# Altium schematic sheet IDD_measurement.SchDoc
size A4; DocumentNumber: 5; Revision: C.1(PCB.SCH); SheetNumber: 5; SheetTotal: 6
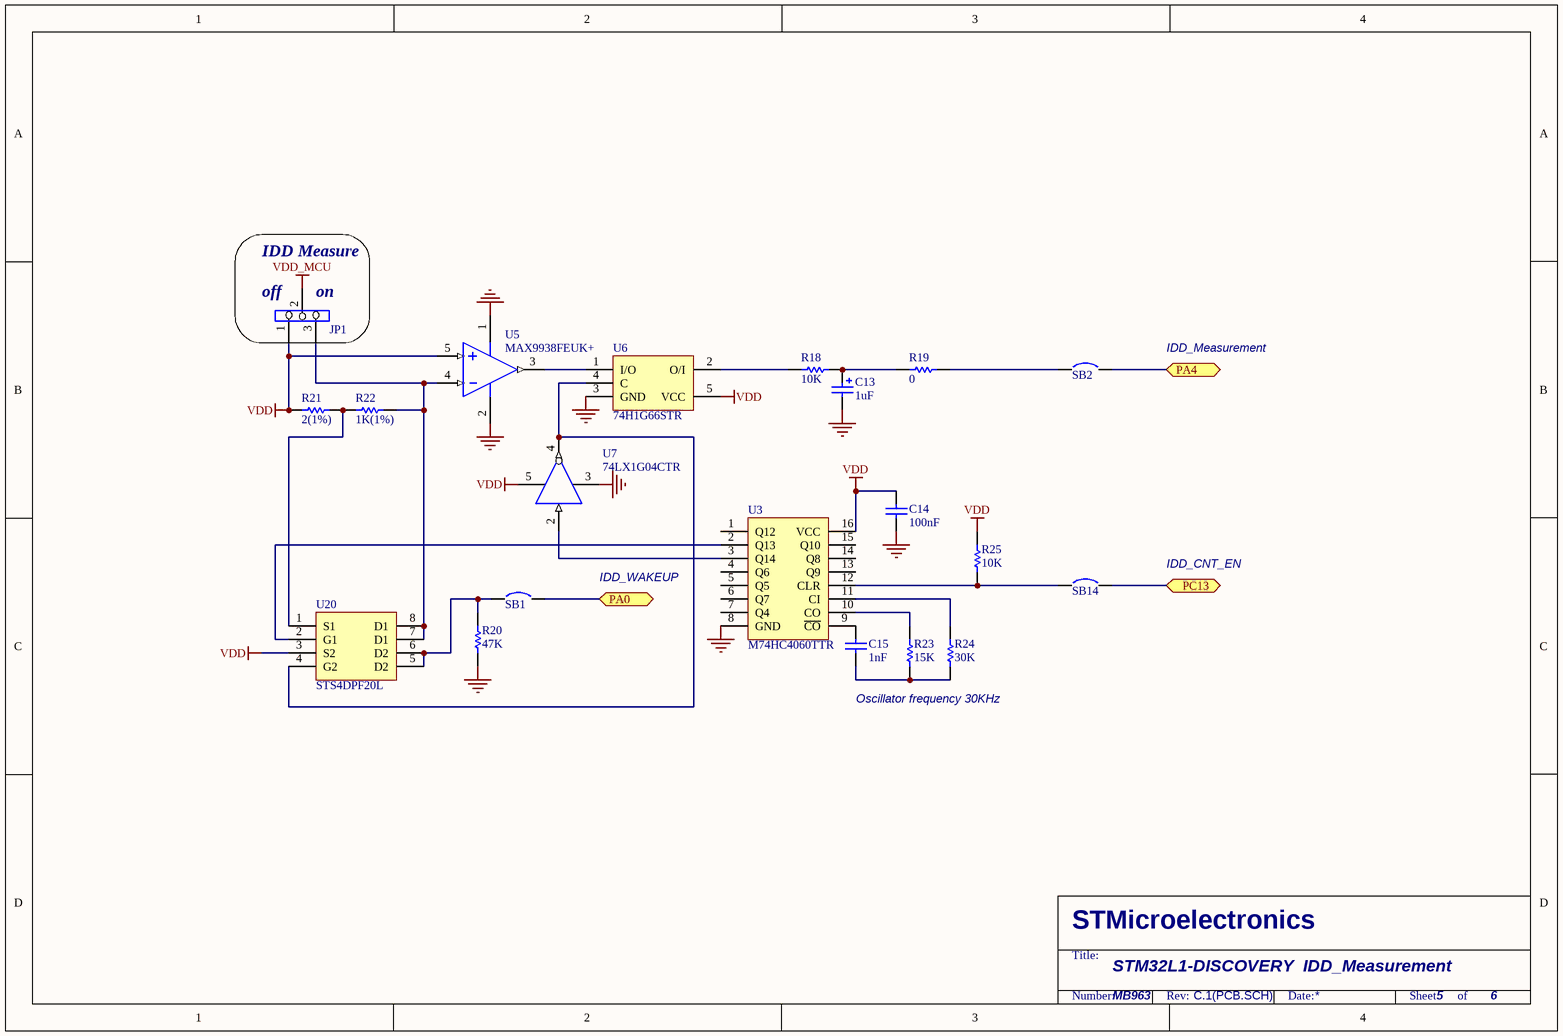
[diagram p0: IDD_measurement.SchDoc]

## Parts
C13  1uF  [0603C]
C14  100nF  [0402C]
C15  1nF  [0402C]
JP1  (no value)  [SIP3]
R18  10K  [0402R]
R19  0  [0402R]
R20  47K  [0402R]
R21  2(1%)  [0402R]
R22  1K(1%)  [0402R]
R23  15K  [0402R]
R24  30K  [0402R]
R25  10K  [0402R]
SB1  Circuit Breaker  [JP2_SMD]  (value not drawn)
SB2  Circuit Breaker  [JP2_SMD]  (value not drawn)
SB14  Circuit Breaker  [JP2_SMD]  (value not drawn)
U3  M74HC4060TTR  [TSSOP16]
U5  MAX9938FEUK+  [SOT-23-5L]
U6  74H1G66STR  [SOT-23-5L]
U7  74LX1G04CTR  [SOT323-5L]
U20  STS4DPF20L  [SO8_M]

## Ports
PA0, PA4, PC13

## Nets
GND: C13.2 C14.1 R20.2 U3.8(GND) U5.1(GND) U5.2(GND) U6.3(GND) U7.3(GND)
VDD: C14.2 JP1.1 R21.2 R25.1 U3.16(VCC) U5.5(Vp) U6.5(VCC) U7.5(VCC) U20.3(S2)
VDD_MCU: JP1.2
PA0: SB1.2 ; port PA0
PA4: SB2.2 ; port PA4
PC13: SB14.2 ; port PC13
NetC13_1: C13.1 R18.2 R19.1
NetC15_1: C15.1 U3.9(~{CO})
NetC15_2: C15.2 R23.2 R24.2
NetJP1_3: JP1.3 R22.1 U5.4(Vm) U20.7(D1) U20.8(D1)
NetR18_1: R18.1 U6.2(O/I)
NetR19_2: R19.2 SB2.1
NetR20_1: R20.1 SB1.1 U20.5(D2) U20.6(D2)
NetR21_1: R21.1 R22.2 U20.1(S1)
NetR23_1: R23.1 U3.10(CO)
NetR24_1: R24.1 U3.11(CI)
NetR25_2: R25.2 SB14.1 U3.12(CLR)
NetU3_2: U3.2(Q13) U20.2(G1)
NetU3_3: U3.3(Q14) U7.2(1A)
NetU5_3: U5.3(OUT) U6.1(I/O)
NetU6_4: U6.4(C) U7.4(1Y) U20.4(G2)

Not connected (* = marked no-connect by the designer): U3 1(Q12) 4(Q6) 5(Q5) 6(Q7) 7(Q4) 13(Q9) 14(Q8) 15(Q10); U7 1(NC)

## Notes on the sheet
- (near JP1) IDD Measure
- (near JP1) off
- (near JP1) on
- IDD_Measurement
- IDD_WAKEUP
- IDD_CNT_EN
- Oscillator frequency 30KHz
- STM32L1-DISCOVERY  IDD_Measurement
- MB963
- STMicroelectronics
- Title:
- Number:
- Rev:
- Date:
- Sheet       of

## Library data of the parts
C13 = Cap Pol1: Polarized Capacitor (Radial); Published: 8-Jun-2000; Revision: July-2002: Re-released for DXP Platform.; Publisher: Altium Limited; Value: 1uF
C14 C15 = Cap: Capacitor; Published: 8-Jun-2000; Revision: July-2002: Re-released for DXP Platform.; Publisher: Altium Limited
  C14: Value: 100nF
  C15: Value: 1nF
JP1 = Jumper3
R18-R20 R22-R25 = res1: Resistor; Published: 8-Jun-2000; Revision: July-2002: Re-released for DXP Platform.; Publisher: Altium Limited
  R18 R25: Value: 10K
  R19: Value: 0
  R20: Value: 47K
  R22: Value: 1K
  R23: Value: 15K
  R24: Value: 30K
R21 = res1: Resistor; Value: 2; Published: 8-Jun-2000; Revision: July-2002: Re-released for DXP Platform.; Publisher: Altium Limited
SB1 SB2 SB14 = Circuit Breaker: Solder: YES; Published: 24-Mar-1999; Revision: July-2002: Re-released for DXP Platform.; Publisher: Altium Limited
U3 = M74HC4060TTR: Provided: ST
U5 = MAX9938: Precision Current-Sense Amplifier
U6 = 74H1G66STR: Provided: ST
U7 = 74LX1G04CTR: Provided: ST
U20 = STS4DPF20L: STS4DPF20L SO8 package; Manuf_1: STM; Provided: ST; LatestRevisionDate: 17-Jul-2002; LatestRevisionNote: Re-released for DXP Platform.; Publisher: Altium Limited; Value: STS4DPF20L; Manuf_Part_1: STS4DPF20L; Order: STS4DPF20L